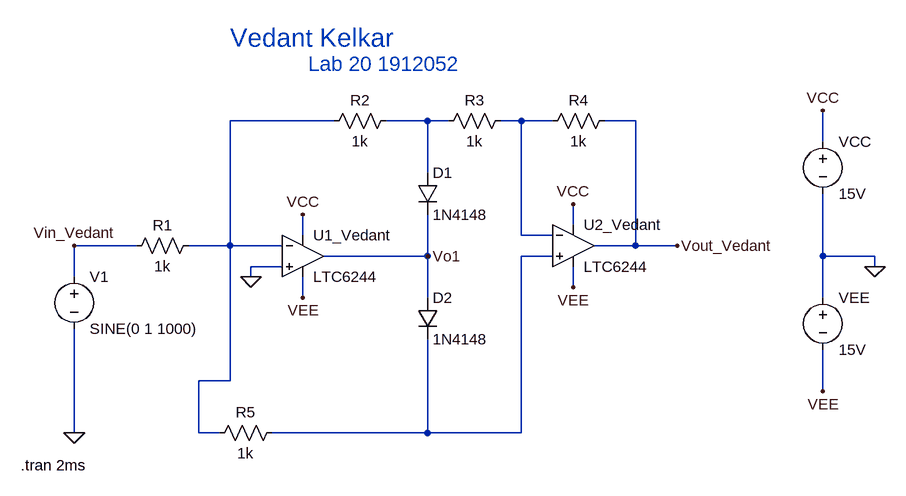
[diagram p0: schematic AC2_Lab20.asc]
AC2_Lab20.asc, the LTspice schematic file:
Version 4
SHEET 1 1044 680
WIRE 192 80 32 80
WIRE 336 80 272 80
WIRE 368 80 336 80
WIRE 480 80 448 80
WIRE 528 80 480 80
WIRE 656 80 608 80
WIRE 944 112 944 64
WIRE 336 160 336 80
WIRE 560 240 560 208
WIRE 144 256 144 224
WIRE 480 256 480 80
WIRE 528 256 480 256
WIRE -112 272 -208 272
WIRE 32 272 32 80
WIRE 32 272 -32 272
WIRE 112 272 32 272
WIRE 656 272 656 80
WIRE 656 272 592 272
WIRE 720 272 656 272
WIRE 336 288 336 224
WIRE 336 288 176 288
WIRE 528 288 480 288
WIRE 944 288 944 192
WIRE 1024 288 944 288
WIRE 112 304 64 304
WIRE 1024 304 1024 288
WIRE -208 320 -208 272
WIRE 64 320 64 304
WIRE 560 336 560 304
WIRE 144 352 144 320
WIRE 336 352 336 288
WIRE 944 352 944 288
WIRE 32 480 32 272
WIRE 32 480 -16 480
WIRE 944 496 944 432
WIRE -208 560 -208 400
WIRE -16 560 -16 480
WIRE 16 560 -16 560
WIRE 336 560 336 416
WIRE 336 560 96 560
WIRE 480 560 480 288
WIRE 480 560 336 560
FLAG 64 320 0
FLAG -208 272 Vin_Vedant
FLAG 720 272 Vout_Vedant
FLAG 560 208 VCC
FLAG 144 224 VCC
FLAG 144 352 VEE
FLAG 560 336 VEE
FLAG 1024 304 0
FLAG 944 496 VEE
FLAG 944 64 VCC
FLAG 336 288 Vo1
FLAG -208 560 0
SYMBOL OpAmps\\LTC6244 144 288 R0
SYMATTR InstName U1_Vedant
SYMBOL voltage -208 304 R0
WINDOW 123 0 0 Left 0
WINDOW 39 0 0 Left 0
SYMATTR InstName V1
SYMATTR Value SINE(0 1 1000)
SYMBOL res -16 256 R90
WINDOW 0 0 56 VBottom 2
WINDOW 3 32 56 VTop 2
SYMATTR InstName R1
SYMATTR Value 1k
SYMBOL res 288 64 R90
WINDOW 0 0 56 VBottom 2
WINDOW 3 32 56 VTop 2
SYMATTR InstName R2
SYMATTR Value 1k
SYMBOL res 464 64 R90
WINDOW 0 0 56 VBottom 2
WINDOW 3 32 56 VTop 2
SYMATTR InstName R3
SYMATTR Value 1k
SYMBOL res 624 64 R90
WINDOW 0 0 56 VBottom 2
WINDOW 3 32 56 VTop 2
SYMATTR InstName R4
SYMATTR Value 1k
SYMBOL OpAmps\\LTC6244 560 272 R0
SYMATTR InstName U2_Vedant
SYMBOL diode 320 160 R0
SYMATTR InstName D1
SYMATTR Value 1N4148
SYMBOL diode 320 352 R0
SYMATTR InstName D2
SYMATTR Value 1N4148
SYMBOL res 112 544 R90
WINDOW 0 0 56 VBottom 2
WINDOW 3 32 56 VTop 2
SYMATTR InstName R5
SYMATTR Value 1k
SYMBOL voltage 944 96 R0
WINDOW 123 0 0 Left 0
WINDOW 39 0 0 Left 0
SYMATTR InstName VCC
SYMATTR Value 15V
SYMBOL voltage 944 336 R0
WINDOW 123 0 0 Left 0
WINDOW 39 0 0 Left 0
SYMATTR InstName VEE
SYMATTR Value 15V
TEXT 32 -48 Left 4 ;Vedant Kelkar
TEXT 152 -8 Left 3 ;Lab 20 1912052
TEXT -290 610 Left 2 !.tran 2ms

The netlist it stands for:
* AC2_Lab20.asc
XU1_Vedant 0 N001 VCC VEE Vo1 LTC6244  ; pins In+ In- V+ V- OUT
V1 Vin_Vedant 0 SINE(0 1 1000)
R1 N001 Vin_Vedant 1k
R2 N002 N001 1k
R3 N003 N002 1k
R4 Vout_Vedant N003 1k
XU2_Vedant N004 N003 VCC VEE Vout_Vedant LTC6244  ; pins In+ In- V+ V- OUT
D1 N002 Vo1 1N4148
D2 Vo1 N004 1N4148
R5 N004 N001 1k
VCC VCC 0 15V
VEE 0 VEE 15V
.model D D
.lib standard.dio
* Vedant Kelkar
* Lab 20 1912052
.tran 2ms
.backanno
.end